# Altium schematic sheet ArbPwrBoost_P6.SchDoc: =ProjectTitle
size B; Engineer: Hab Collector; Organization: Altium Limited; Address1: 3621 Gin Way; Address2: Snellville, GA 30039; SheetNumber: 6; SheetTotal: 7
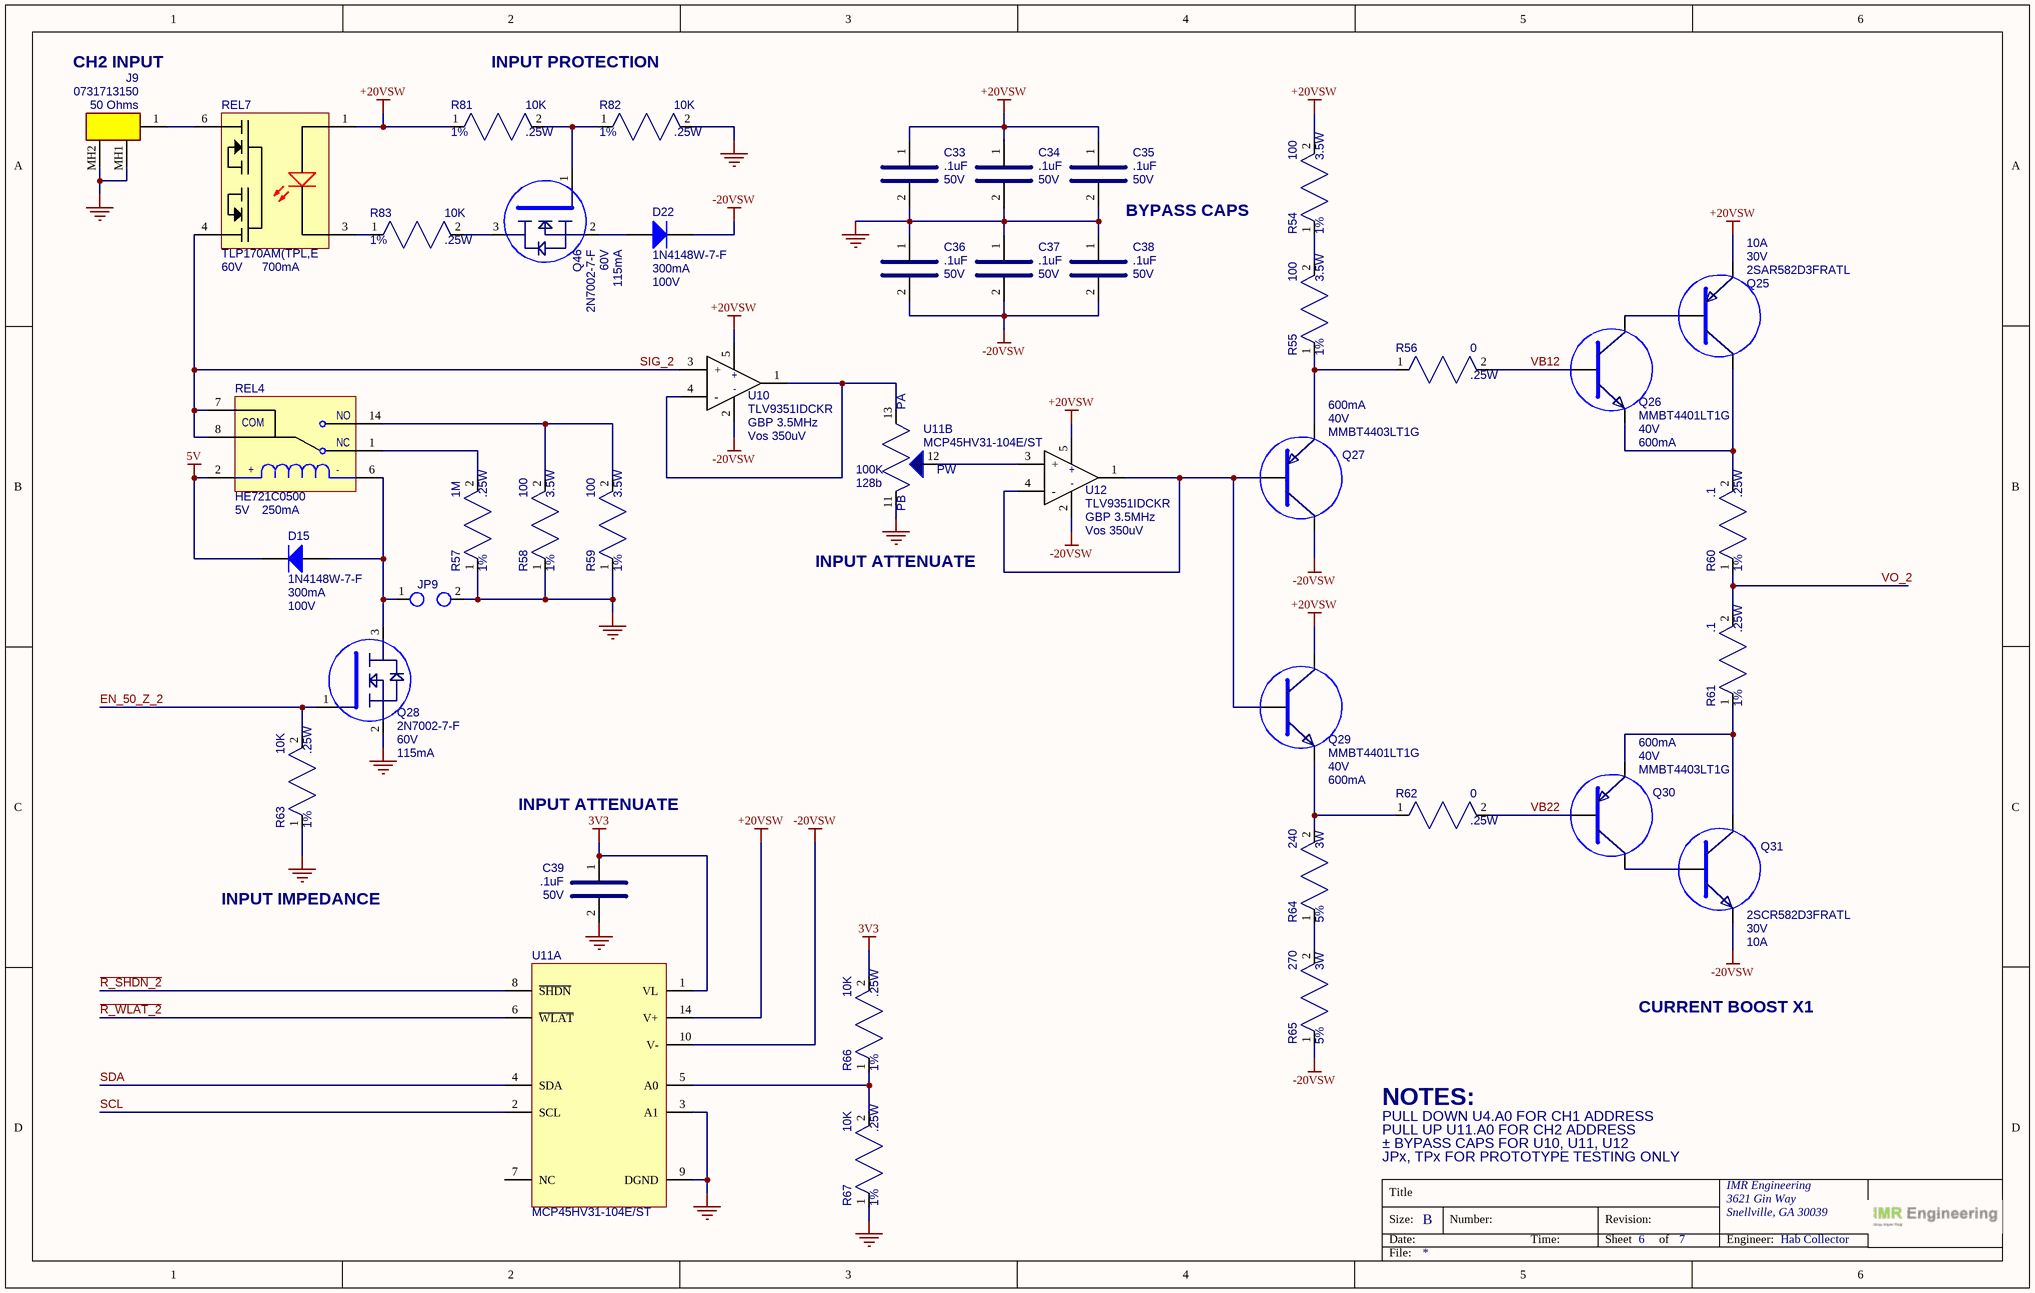
[diagram p0: ArbPwrBoost_P6.SchDoc]

## Parts
C33  value .1uF  Voltage: 50V  [CAP_0805]  (hidden comment: KGM21NR71H104KT)
C34  value .1uF  Voltage: 50V  [CAP_0805]  (hidden comment: KGM21NR71H104KT)
C35  value .1uF  Voltage: 50V  [CAP_0805]  (hidden comment: KGM21NR71H104KT)
C36  value .1uF  Voltage: 50V  [CAP_0805]  (hidden comment: KGM21NR71H104KT)
C37  value .1uF  Voltage: 50V  [CAP_0805]  (hidden comment: KGM21NR71H104KT)
C38  value .1uF  Voltage: 50V  [CAP_0805]  (hidden comment: KGM21NR71H104KT)
C39  value .1uF  Voltage: 50V  [CAP_0805]  (hidden comment: KGM21NR71H104KT)
D15  value 100V  Current: 300mA  [SOD123]  (hidden comment: 1N4148W-7-F)
D22  value 100V  Current: 300mA  [SOD123]  (hidden comment: 1N4148W-7-F)
J9  value 50 Ohms  [731713150]  (hidden comment: 0731713150)
JP9  PREC002SFAN-RC  [HDR_1X2_100MILL]  (value not drawn)
Q25  value 30V  Current: 10A  [TO-252]  (hidden comment: 2SAR582D3FRATL)
Q26  value 40V  Current: 600mA  [SOT-23]  (hidden comment: MMBT4401LT1G)
Q27  value 40V  Current: 600mA  [SOT-23]  (hidden comment: MMBT4403LT1G)
Q28  value 60V  Current: 115mA  [SOT-23]  (hidden comment: 2N7002-7-F)
Q29  value 40V  Current: 600mA  [SOT-23]  (hidden comment: MMBT4401LT1G)
Q30  value 40V  Current: 600mA  [SOT-23]  (hidden comment: MMBT4403LT1G)
Q31  value 30V  Current: 10A  [TO-252]  (hidden comment: 2SCR582D3FRATL)
Q46  value 60V  Current: 115mA  [SOT-23]  (hidden comment: 2N7002-7-F)
R54  value 100  Power: 3.5W  Tolerance: 1%  [RES_2512]  (hidden comment: ALN2512F100RE-1)
R55  value 100  Power: 3.5W  Tolerance: 1%  [RES_2512]  (hidden comment: ALN2512F100RE-1)
R56  value 0  Power: .25W  [RES_0805]  (hidden comment: RC0805JR-070RL)
R57  value 1M  Power: .25W  Tolerance: 1%  [RES_0805]  (hidden comment: RC0805FR-7W1ML)
R58  value 100  Power: 3.5W  Tolerance: 1%  [RES_2512]  (hidden comment: ALN2512F100RE-1)
R59  value 100  Power: 3.5W  Tolerance: 1%  [RES_2512]  (hidden comment: ALN2512F100RE-1)
R60  value .1  Power: .25W  Tolerance: 1%  [RES_1206]  (hidden comment: 311-0.1LWCT-ND)
R61  value .1  Power: .25W  Tolerance: 1%  [RES_1206]  (hidden comment: 311-0.1LWCT-ND)
R62  value 0  Power: .25W  [RES_0805]  (hidden comment: RC0805JR-070RL)
R63  value 10K  Power: .25W  Tolerance: 1%  [RES_0805]  (hidden comment: RC0805FR-7W10KL)
R64  value 240  Power: 3W  Tolerance: 5%  [RES_2512]  (hidden comment: RC2512JK-07240RL)
R65  value 270  Power: 3W  Tolerance: 5%  [RES_2512]  (hidden comment: RC2512JK-07270RL)
R66  value 10K  Power: .25W  Tolerance: 1%  [RES_0805]  (hidden comment: RC0805FR-7W10KL)
R67  value 10K  Power: .25W  Tolerance: 1%  [RES_0805]  (hidden comment: RC0805FR-7W10KL)
R81  value 10K  Power: .25W  Tolerance: 1%  [RES_0805]  (hidden comment: RC0805FR-7W10KL)
R82  value 10K  Power: .25W  Tolerance: 1%  [RES_0805]  (hidden comment: RC0805FR-7W10KL)
R83  value 10K  Power: .25W  Tolerance: 1%  [RES_0805]  (hidden comment: RC0805FR-7W10KL)
REL4  value 5V  Current: 250mA  [HE700]  (hidden comment: HE721C0500)
REL7  value 60V  Current: 700mA  [SOP-6]  (hidden comment: TLP170AM(TPL,E)
U10  value GBP 3.5MHz  Vos: Vos 350uV  [SOT-353]  (hidden comment: TLV9351IDCKR)
U11  value 100K  TAP: 128b  [TSSOP-14]  (hidden comment: MCP45HV31-104E/ST)  (parts A,B of 2)
U12  value GBP 3.5MHz  Vos: Vos 350uV  [SOT-353]  (hidden comment: TLV9351IDCKR)

## Nets
3V3: C39.1 R66.2 U11.1(VL)
5V: D15.2(K) REL4.2
+20VSW: C33.1 C34.1 C35.1 Q25.2(E) Q29.3(C) R54.2 R81.1 REL7.1 U10.5 U11.14(V+) U12.5
-20VSW: C36.2 C37.2 C38.2 D22.2(K) Q27.3(C) Q31.2(E) R65.1 U10.2 U11.10(V-) U12.2
GND: C33.2 C34.2 C35.2 C36.1 C37.1 C38.1 C39.2 J9.MH1 J9.MH2 JP9.2 Q28.2(E) R57.1 R58.1 R59.1 R63.1 R67.1 R82.2 U11.3(A1) U11.9(DGND) U11.11(PB0)
~{R_SHDN_2}: U11.8(~{SHDN})
~{R_WLAT_2}: U11.6(~{WLAT})
EN_50_Z_2: Q28.1(B) R63.2
SCL: U11.2(SCL)
SDA: U11.4(SDA)
SIG_2: REL4.7(COM) REL4.8(COM) REL7.4 U10.3(+)
VB12: Q26.1(B) R56.2
VB22: Q30.1(B) R62.2
VO_2: R60.1 R61.2
NetD15_1: D15.1(A) JP9.1 Q28.3(C) REL4.6
NetD22_1: D22.1(A) Q46.2(E)
NetJ9_1: J9.1 REL7.6
NetQ25_1: Q25.1(B) Q26.3(C)
NetQ25_3: Q25.3(C) Q26.2(E) R60.2
NetQ27_1: Q27.1(B) Q29.1(B) U12.1 U12.4(-)
NetQ27_2: Q27.2(E) R55.1 R56.1
NetQ29_2: Q29.2(E) R62.1 R64.2
NetQ30_2: Q30.2(E) Q31.3(C) R61.1
NetQ30_3: Q30.3(C) Q31.1(B)
NetQ46_1: Q46.1(B) R81.2 R82.1
NetQ46_3: Q46.3(C) R83.2
NetR54_1: R54.1 R55.2
NetR57_2: R57.2 REL4.1(NC)
NetR58_2: R58.2 R59.2 REL4.14(NO)
NetR64_1: R64.1 R65.2
NetR66_1: R66.1 R67.2 U11.5(A0)
NetR83_1: R83.1 REL7.3
NetU10_1: U10.1 U10.4(-) U11.13(PA)
NetU11_12: U11.12(PW0) U12.3(+)

Not connected (* = marked no-connect by the designer): U11 7(NC)

## Notes on the sheet
- CH2 INPUT
- INPUT PROTECTION
- BYPASS CAPS
- INPUT ATTENUATE
- INPUT IMPEDANCE
- CURRENT BOOST X1
- NOTES:
- PULL DOWN U4.A0 FOR CH1 ADDRESS
- PULL UP U11.A0 FOR CH2 ADDRESS
- ± BYPASS CAPS FOR U10, U11, U12
- JPx, TPx FOR PROTOTYPE TESTING ONLY
- Title
- Size:
- Date:
- B
- Number:
- Time:
- Revision:
- Sheet
- of
- IMR Engineering
- Engineer:
- File:
- (in symbol IC_MCP45HV31-104E/ST, part B) PW; PB
- (in symbol RELAY_HE721C0500) +; -

## Library data of the parts
C33-C39 = CAP_SMD_0.1UF_50V_0805: CAP CER 0.1UF 50V X7R 0805; MFG: KYOCERA AVX; Case/Package: 0805; MFG_PN: KGM21NR71H104KT; Supplier 1: DigiKey; Supplier Part Number 1: 478-KGM21NR71H104KTCT-ND; Unit Price: .1
D15 D22 = DIODE_1N4148W-7-F: RELAY REED SPDT 250MA 5V; MFG: Diodes Inc; Case/Package: SOD-123; Supplier 1: DigiKey; Supplier Part Number 1: 1N4148W-FDICT-ND; Unit Price: .16; MFG_PN: 1N4148W-7-F
J9 = CONN_MOLEX_0731713150: CONN BNC RCPT R/A 50 OHM PCB; MFG: Molex; Case/Package: 73099-2; Supplier 1: DigiKey; Supplier Part Number 1: WM20430-ND; Unit Price: 1.40; MFG_PN: 0731713150
JP9 = CONN_JUMPER_2P_100MIL_VERT: CONN HEADER VERT 2POS 2.54MM; MFG: Sullins Connector Solutions; Case/Package: 2P_2.54MM; MFG_PN: PREC002SFAN-RC; Supplier 1: Digi-Key; Supplier Part Number 1: S1212EC-02-ND; Value: *; Unit Price: .07
Q25 = BJT_PNP_2SAR582D3FRATL: TRANS PNP 30V 5.7A TO-252; MFG: Rohm Semiconductor; Case/Package: TO-252; Supplier 1: DigiKey; Supplier Part Number 1: 846-2SAR582D3FRATLCT-ND; Unit Price: 1.59; MFG_PN: 2SAR582D3FRATL
Q26 Q29 = BJT_NPN_MMBT4401LT1G: TRANS NPN 40V 0.6A SOT23-3; MFG: On Semiconductor; Case/Package: SOT-23; Supplier 1: DigiKey; Supplier Part Number 1: MMBT4401LT1GOSCT-ND; Unit Price: .13; MFG_PN: MMBT4401LT1G
Q27 Q30 = BJT_PNP_MMBT4403LT1G: TRANS PNP 40V 0.6A SOT23-3; MFG: On Semiconductor; Case/Package: SOT-23; Supplier 1: DigiKey; Supplier Part Number 1: MMBT4403LT1GOSCT-ND; Unit Price: .13; MFG_PN: MMBT4403LT1G
Q28 Q46 = MOSFET_NCH_2N7002-7-F: MOSFET N-CH 60V 115MA SOT23-3; MFG: Diodes Inc; Case/Package: SOT-23; Supplier 1: DigiKey; Supplier Part Number 1: 2N7002-FDICT-ND; Unit Price: .20; MFG_PN: 2N7002-7-F
Q31 = BJT_NPN_2SCR582D3FRATL: TRANS NPN 30V 10A TO-252; MFG: Rohm Semiconductor; Case/Package: TO-252; Supplier 1: DigiKey; Supplier Part Number 1: 849-2SCR582D3FRATL-ND; Unit Price: 1.76; MFG_PN: 2SCR582D3FRATL
R54 R55 R58 R59 = RES_SMD_100_0805_3.5W_1%: RES SMD 100 OHM 1% 3.5W 2512; MFG: Ohmite; Case/Package: 2512; MFG_PN: ALN2512F100RE-1; Supplier 1: DigiKey; Supplier Part Number 1: 273-ALN2512F100RE-1CT-ND; Unit Price: 1.50
R56 R62 = RES_SMD_0_0805_1/8W_1%: RES SMD 0 OHM 1% 1/8W 0805; MFG: Yageo; Case/Package: 0805; MFG_PN: RC0805JR-070RL; Supplier 1: DigiKey; Supplier Part Number 1: 311-0.0ARCT-ND; Unit Price: .1; Tolerance: 1%
R57 = RES_SMD_1M_0805_1/4W_1%: RES SMD 1K OHM 1% 1/4W 0805; MFG: Yageo; Case/Package: 0805; MFG_PN: RC0805FR-7W1ML; Supplier 1: DigiKey; Supplier Part Number 1: 13-RC0805FR-7W1MLCT-ND; Unit Price: .10
R60 R61 = RES_SMD_0.1_1206_1/4W_1%: RES SMD 0.1 OHM 1% 1/4W 1206; MFG: Yageo; Case/Package: 1206; MFG_PN: 311-0.1LWCT-ND; Supplier 1: DigiKey; Supplier Part Number 1: 311-100KCRCT-ND; Unit Price: .45
R63 R66 R67 R81-R83 = RES_SMD_10K_0805_1/4W_1%: RES SMD 10K OHM 1% 1/4W 0805; MFG: Yageo; Case/Package: 0805; MFG_PN: RC0805FR-7W10KL; Supplier 1: DigiKey; Supplier Part Number 1: 13-RC0805FR-7W10KLCT-ND; Unit Price: .10
R64 = RES_SMD_240_2512_3W_5%: RES 240 OHM 5% 3W 2512; MFG: Yageo; Case/Package: 2512; MFG_PN: RC2512JK-07240RL; Supplier 1: DigiKey; Supplier Part Number 1: 13-RC2512JK-07240RLCT-ND; Unit Price: .28
R65 = RES_SMD_270_2512_3W_5%: RES 270 OHM 5% 1W 2512; MFG: Yageo; Case/Package: 2512; MFG_PN: RC2512JK-07270RL; Supplier 1: DigiKey; Supplier Part Number 1: 13-RC2512JK-07270RLCT-ND; Unit Price: .21
REL4 = RELAY_HE721C0500: RELAY REED SPDT 250MA 5V; MFG: Littlefuse; Case/Package: HE700; Supplier 1: DigiKey; Supplier Part Number 1: HE112-ND; Unit Price: 3.77; MFG_PN: HE721C0500
REL7 = RELAY_TLP170AM(TPL,E: SSR RELAY SPST-NO 700MA 0-60V; MFG: Toshiba; Case/Package: SOP-6; Supplier 1: DigiKey; Supplier Part Number 1: 264-TLP170AM(TPLECT-ND; Unit Price: 1.33; MFG_PN: TLP170AM(TPL,E
U10 U12 = OPAMP_TLV9351IDCKR: IC OPAMP GP 3.5MHZ 350uV C70-5; MFG: Texas Instruments; Package/Case: SOT-353; Supplier 1: DigiKey; MFG_PN: TLV9351IDCKR; Unit Price: .49; Supplier Part Number 1: 296-TLV9351IDCKRCT-ND
U11 = IC_MCP45HV31-104E/ST: IC DGT POT 100KOHM 128TP 14TSSOP; MFG: Microchip; Case/Package: TSSOP-14; Supplier 1: DigiKey; Supplier Part Number 1: MCP45HV31-104E/ST-ND; Unit Price: 1.82; MFG_PN: MCP45HV31-104E/ST